# Altium schematic sheet Connector.SchDoc
size A3
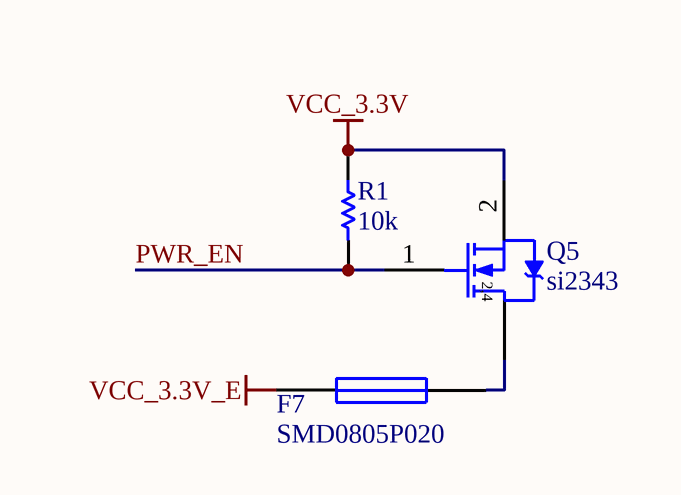
[diagram p0: Connector.SchDoc]

## Parts
F7  SMD0805P020  [0805R]
Q5  si2343  [SOT23-3]
R1  10k  [0603r]

## Nets
VCC_3.3V: Q5.2(S) R1.1
VCC_3.3V_E: F7.1
PWR_EN: Q5.1(G) R1.2
NetF7_2: F7.2 Q5.3(D)

## Notes on the sheet
- (in symbol BUK92150-55A) 2,4

## Library data of the parts
F7 = Fuse 1: Fuse; Published: 8-Jun-2000; LatestRevisionDate: 17-Jul-2002; LatestRevisionNote: Re-released for DXP Platform.; PackageReference: PIN-W2/E2.8; Publisher: Altium Limited
Q5 = BUK92150-55A: Published: 8-Jun-2000; LatestRevisionDate: 17-Jul-2002; LatestRevisionNote: Re-released for DXP Platform.; DatasheetVersion: 6-Oct-1997; PackageVersion: Aug-1998; PackageReference: TSOP-6; Publisher: Altium Limited; PackageDescription: SOT-457/SC-74; 6 Leads; Body 3.1 x 3 mm, inc. leads (LxW max); ComponentLink1Description: Manufacturer Link; ComponentLink1URL: http://www.vishay.com/; ComponentLink2Description: Datasheet; ComponentLink2URL: http://www.vishay.com/docs/70192/70192.pdf
R1 = Res1: Resistor; Value: 1K; Published: 8-Jun-2000; LatestRevisionDate: 17-Jul-2002; LatestRevisionNote: Re-released for DXP Platform.; PackageReference: AXIAL-0.3; Publisher: Altium Limited